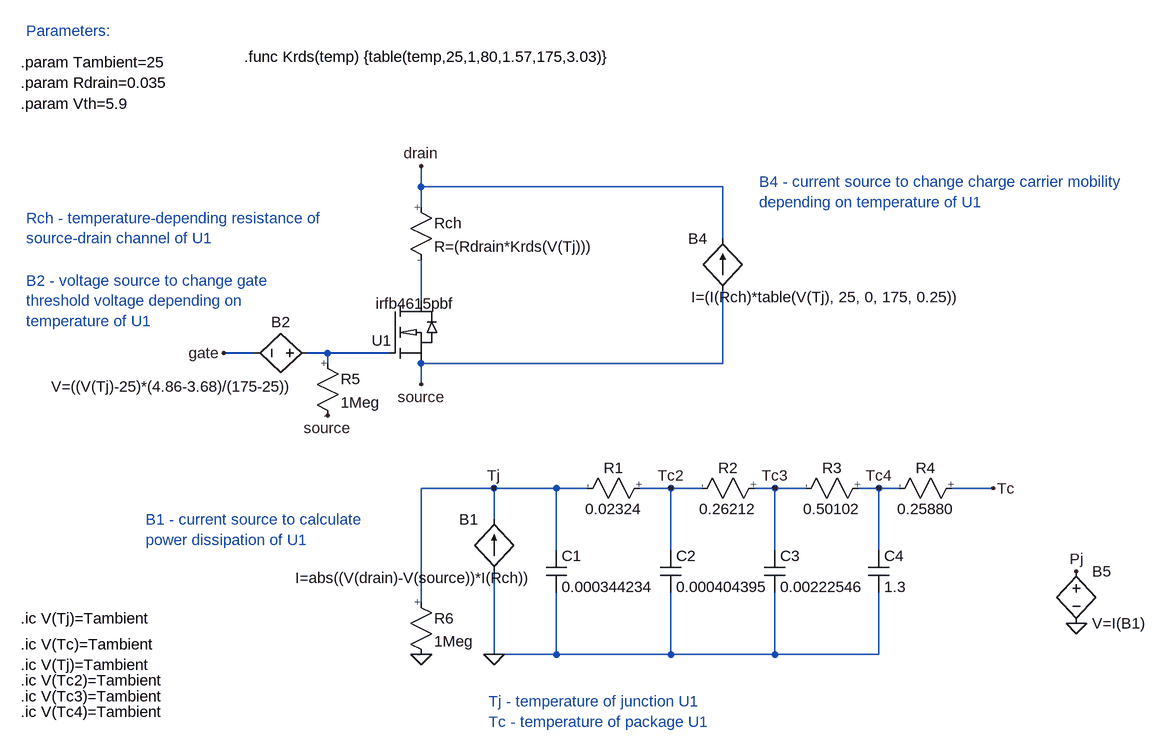
[diagram p0: schematic IRFB4615PBF_therm.asc]
IRFB4615PBF_therm.asc, the LTspice schematic file:
Version 4
SHEET 1 3624 884
WIRE 496 32 496 0
WIRE 960 32 496 32
WIRE 496 64 496 32
WIRE 960 112 960 32
WIRE 496 208 496 144
WIRE 240 288 192 288
WIRE 352 288 320 288
WIRE 448 288 352 288
WIRE 352 304 352 288
WIRE 960 304 960 192
WIRE 960 304 496 304
WIRE 496 336 496 304
WIRE 608 496 496 496
WIRE 704 496 608 496
WIRE 752 496 704 496
WIRE 880 496 832 496
WIRE 928 496 880 496
WIRE 1040 496 1008 496
WIRE 1088 496 1040 496
WIRE 1200 496 1168 496
WIRE 1232 496 1200 496
WIRE 1376 496 1312 496
WIRE 608 544 608 496
WIRE 704 592 704 496
WIRE 880 592 880 496
WIRE 1040 592 1040 496
WIRE 1200 592 1200 496
WIRE 496 672 496 496
WIRE 608 752 608 624
WIRE 704 752 704 656
WIRE 704 752 608 752
WIRE 880 752 880 656
WIRE 880 752 704 752
WIRE 1040 752 1040 656
WIRE 1040 752 880 752
WIRE 1200 752 1200 656
WIRE 1200 752 1040 752
FLAG 608 496 Tj
FLAG 1376 496 Tc
FLAG 496 0 drain
FLAG 496 336 source
FLAG 608 752 0
FLAG 192 288 gate
FLAG 1200 496 Tc4
FLAG 1040 496 Tc3
FLAG 880 496 Tc2
FLAG 1504 704 0
FLAG 1504 624 Pj
FLAG 352 384 source
FLAG 496 752 0
SYMBOL irfb4615pbf 448 208 R0
WINDOW 3 -22 4 Left 2
SYMATTR InstName U1
SYMATTR SpiceLine Vth=Vth
SYMATTR SpiceLine2 Rds_val=0.00001
SYMBOL res 848 480 R90
WINDOW 0 0 56 VBottom 2
WINDOW 3 32 56 VTop 2
SYMATTR InstName R1
SYMATTR Value 0.02324
SYMBOL res 1024 480 R90
WINDOW 0 0 56 VBottom 2
WINDOW 3 32 56 VTop 2
SYMATTR InstName R2
SYMATTR Value 0.26212
SYMBOL res 1184 480 R90
WINDOW 0 0 56 VBottom 2
WINDOW 3 32 56 VTop 2
SYMATTR InstName R3
SYMATTR Value 0.50102
SYMBOL res 1328 480 R90
WINDOW 0 0 56 VBottom 2
WINDOW 3 32 56 VTop 2
SYMATTR InstName R4
SYMATTR Value 0.25880
SYMBOL cap 688 592 R0
SYMATTR InstName C1
SYMATTR Value 0.000344234
SYMBOL cap 864 592 R0
SYMATTR InstName C2
SYMATTR Value 0.000404395
SYMBOL cap 1024 592 R0
SYMATTR InstName C3
SYMATTR Value 0.00222546
SYMBOL cap 1184 592 R0
SYMATTR InstName C4
SYMATTR Value 1.3
SYMBOL bi 608 624 R180
WINDOW 0 24 80 Left 2
WINDOW 3 -62 -10 Left 2
SYMATTR InstName B1
SYMATTR Value I=abs((V(drain)-V(source))*I(Rch))
SYMBOL bv 336 288 M270
WINDOW 0 32 56 VTop 2
WINDOW 3 -36 220 VBottom 2
SYMATTR InstName B2
SYMATTR Value V=((V(Tj)-25)*(4.86-3.68)/(175-25))
SYMBOL bi 960 192 R180
WINDOW 0 24 80 Left 2
WINDOW 3 -368 -10 Left 2
SYMATTR InstName B4
SYMATTR Value I=(I(Rch)*table(V(Tj), 25, 0, 175, 0.25))
SYMBOL bv 1504 608 R0
SYMATTR InstName B5
SYMATTR Value V=I(B1)
SYMBOL res 336 288 R0
SYMATTR InstName R5
SYMATTR Value 1Meg
SYMBOL res 480 656 R0
SYMATTR InstName R6
SYMATTR Value 1Meg
SYMBOL res 480 48 R0
SYMATTR InstName Rch
SYMATTR Value R=(Rdrain*Krds(V(Tj)))
TEXT -120 -160 Left 2 !.param Tambient=25
TEXT -120 -128 Left 2 !.param Rdrain=0.035
TEXT -112 80 Left 2 ;Rch - temperature-depending resistance of\nsource-drain channel of U1
TEXT -112 -208 Left 2 ;Parameters:
TEXT 600 824 Left 2 ;Tj - temperature of junction U1\nTc - temperature of package U1
TEXT 224 -168 Left 2 !.func Krds(temp) {table(temp,25,1,80,1.57,175,3.03)}
TEXT -120 696 Left 2 !.ic V(Tj)=Tambient
TEXT -120 736 Left 2 !.ic V(Tc)=Tambient
TEXT 72 544 Left 2 ;B1 - current source to calculate\npower dissipation of U1
TEXT -112 176 Left 2 ;B2 - voltage source to change gate\nthreshold voltage depending on \ntemperature of U1
TEXT -120 -96 Left 2 !.param Vth=5.9
TEXT -120 768 Left 2 !.ic V(Tj)=Tambient
TEXT -120 792 Left 2 !.ic V(Tc2)=Tambient
TEXT -120 816 Left 2 !.ic V(Tc3)=Tambient
TEXT -120 840 Left 2 !.ic V(Tc4)=Tambient
TEXT 1016 24 Left 2 ;B4 - current source to change charge carrier mobility\ndepending on temperature of U1

The netlist it stands for:
* IRFB4615PBF_therm.asc
XU1 N001 N002 source irfb4615pbf Vth=Vth Rds_val=0.00001  ; pins 1 2 3
R1 Tc2 Tj 0.02324
R2 Tc3 Tc2 0.26212
R3 Tc4 Tc3 0.50102
R4 Tc Tc4 0.25880
C1 Tj 0 0.000344234
C2 Tc2 0 0.000404395
C3 Tc3 0 0.00222546
C4 Tc4 0 1.3
B1 0 Tj I=abs((V(drain)-V(source))*I(Rch))
B2 N002 gate V=((V(Tj)-25)*(4.86-3.68)/(175-25))
B4 source drain I=(I(Rch)*table(V(Tj), 25, 0, 175, 0.25))
B5 Pj 0 V=I(B1)
R5 N002 source 1Meg
R6 Tj 0 1Meg
Rch drain N001 R=(Rdrain*Krds(V(Tj)))
.param Tambient=25
.param Rdrain=0.035
* Rch - temperature-depending resistance of
* source-drain channel of U1
* Parameters:
* Tj - temperature of junction U1
* Tc - temperature of package U1
.func Krds(temp) {table(temp,25,1,80,1.57,175,3.03)}
.ic V(Tj)=Tambient
.ic V(Tc)=Tambient
* B1 - current source to calculate
* power dissipation of U1
* B2 - voltage source to change gate
* threshold voltage depending on
* temperature of U1
.param Vth=5.9
.ic V(Tj)=Tambient
.ic V(Tc2)=Tambient
.ic V(Tc3)=Tambient
.ic V(Tc4)=Tambient
* B4 - current source to change charge carrier mobility
* depending on temperature of U1
.lib .\irfb4615pbf.spi
.backanno
.end